# Altium schematic sheet DualUSB3.0_CON.SchDoc
size 420 x 297 mm; SheetNumber: 6; SheetTotal: 11; ModifiedBy: -; CheckedDate: -; Title2: Title 2; DivGrp: WUT ISE; Designer: G.Kasprowicz
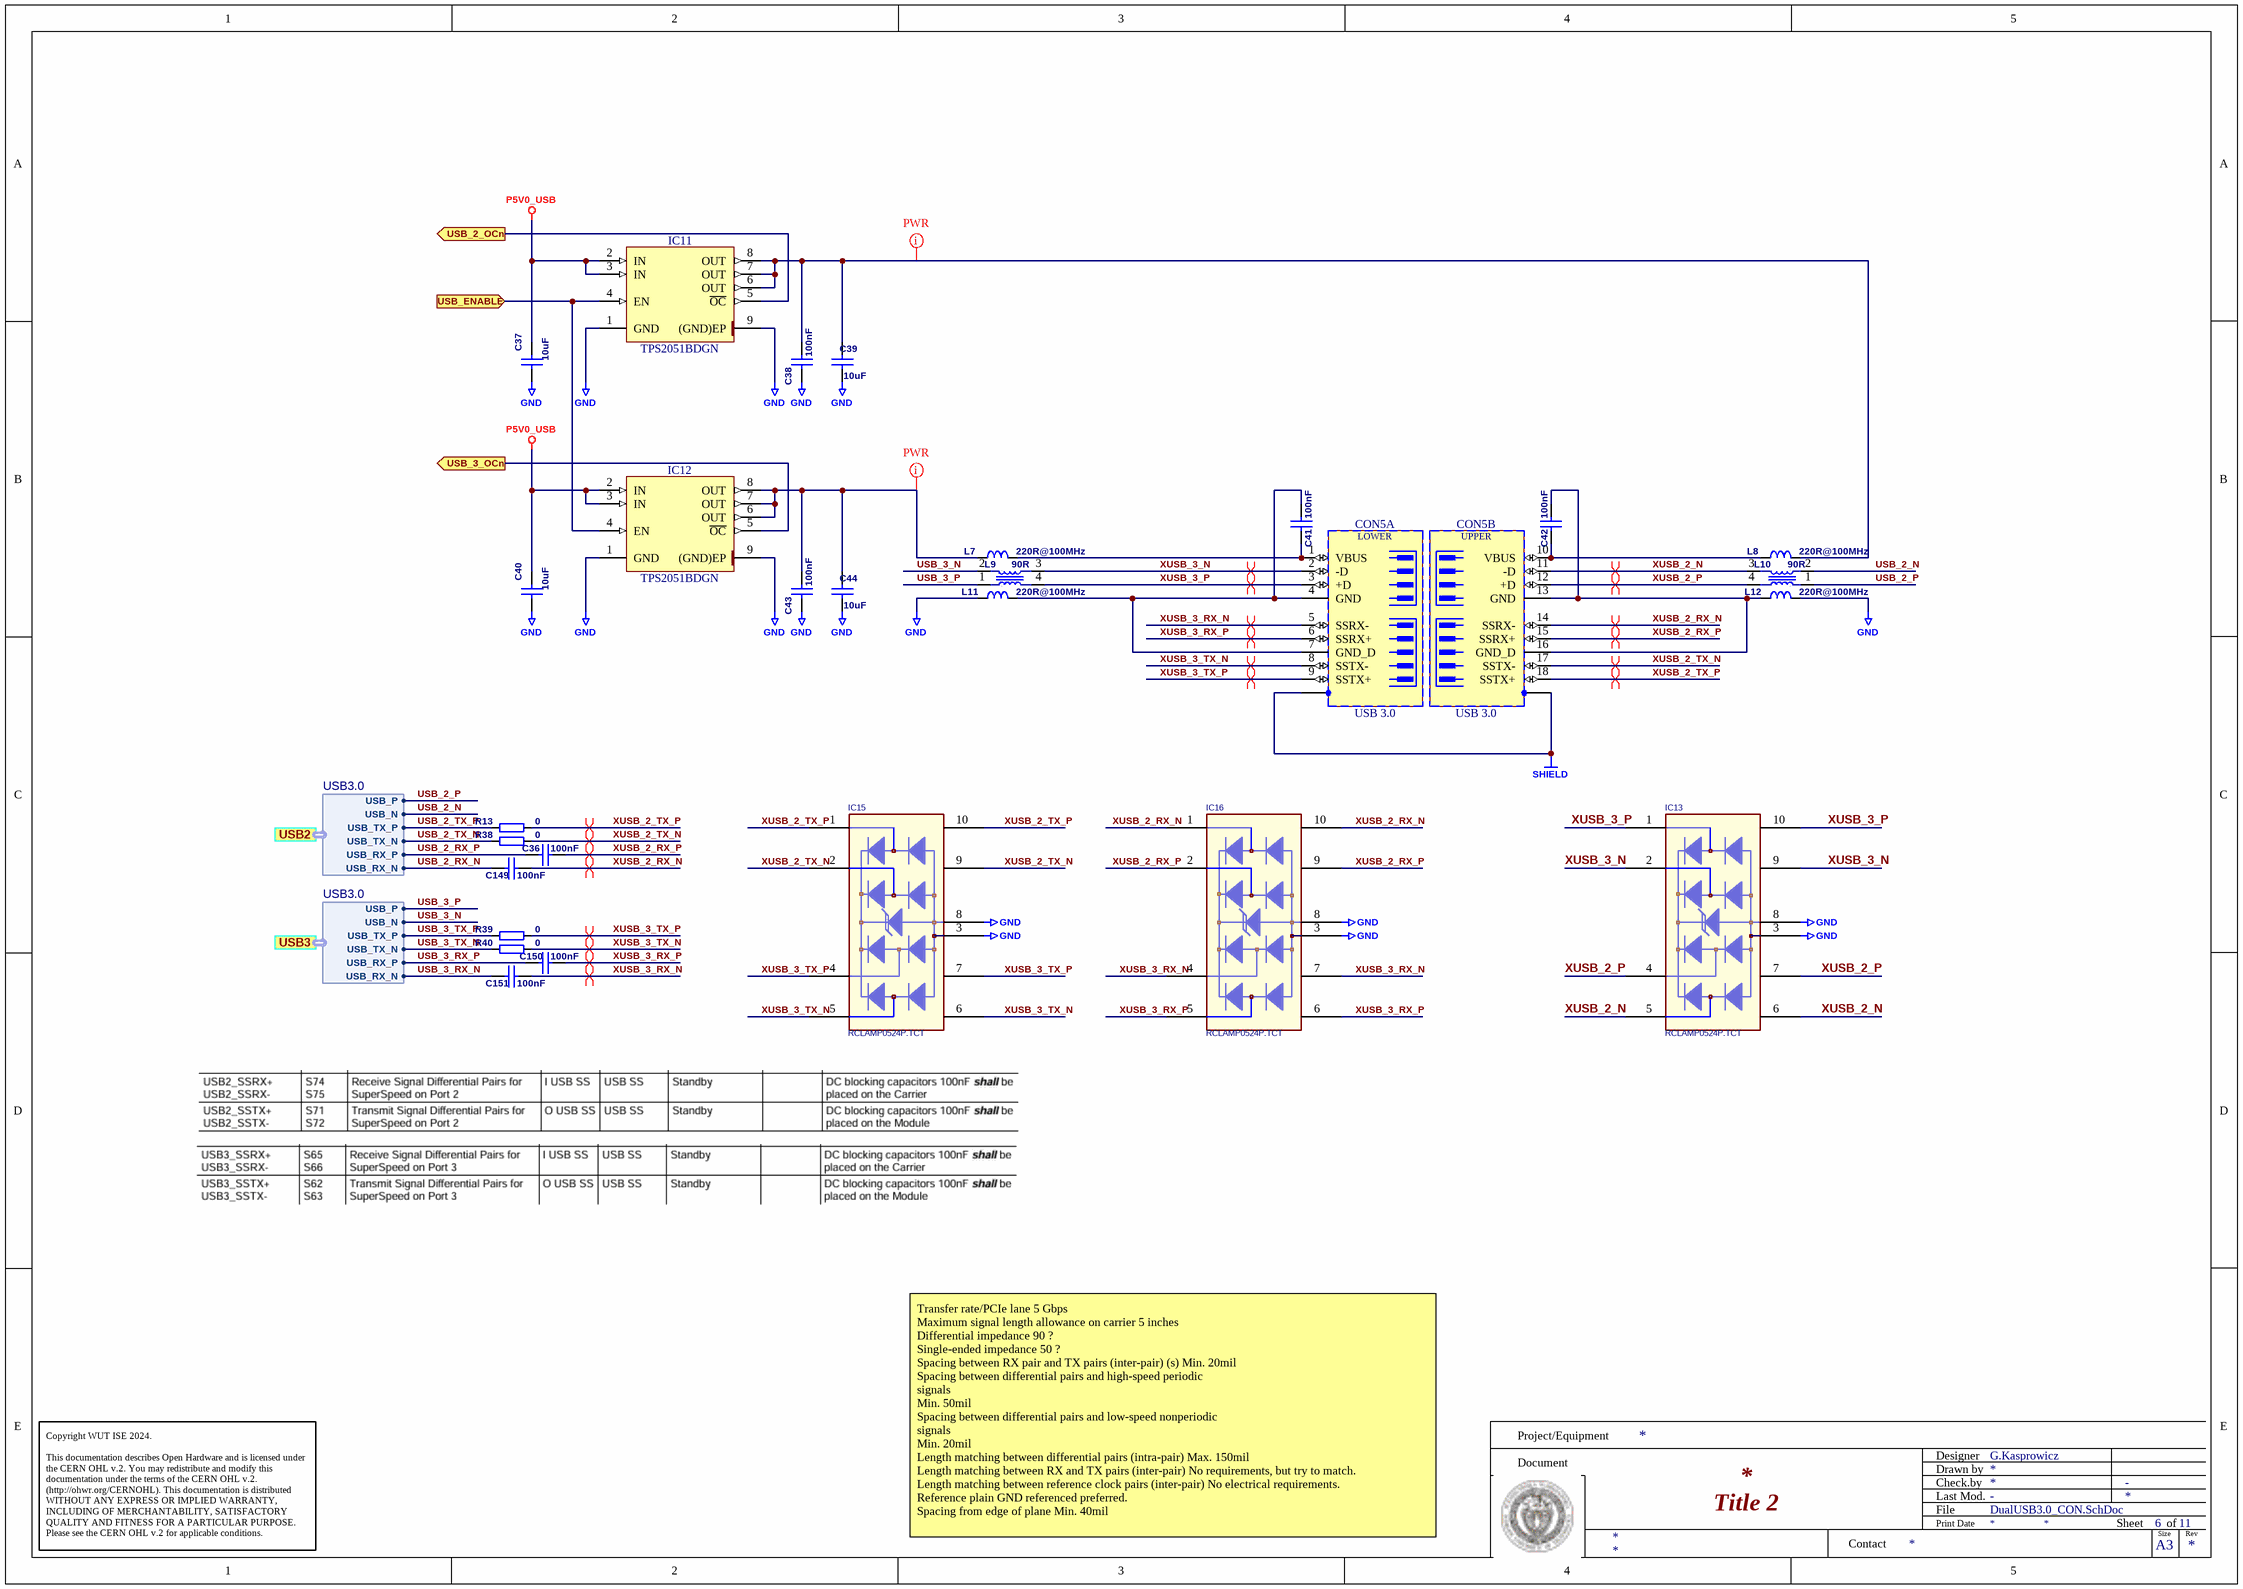
[diagram p0: DualUSB3.0_CON.SchDoc]

## Parts
C36  100nF  [CAPC1005X55N]
C37  10uF  [CAPC2012X135N]
C38  100nF  [CAPC1005X55N]
C39  10uF  [CAPC2012X135N]
C40  10uF  [CAPC2012X135N]
C41  100nF  [CAPC1005X55N]
C42  100nF  [CAPC1005X55N]
C43  100nF  [CAPC1005X55N]
C44  10uF  [CAPC2012X135N]
C149  100nF  [CAPC1005X55N]
C150  100nF  [CAPC1005X55N]
C151  100nF  [CAPC1005X55N]
CON5  USB 3.0  [WURTH_692141030100]  (parts A,B of 2)
IC11  TPS2051BDGN  [SOP65P490X110-9N-R157X189]
IC12  TPS2051BDGN  [SOP65P490X110-9N-R157X189]
IC13  RCLAMP0524P.TCT  [SMDARRAYC_10P4C]
IC15  RCLAMP0524P.TCT  [SMDARRAYC_10P4C]
IC16  RCLAMP0524P.TCT  [SMDARRAYC_10P4C]
L7  220R@100MHz  [INDC2012X105N]
L8  220R@100MHz  [INDC2012X105N]
L9  value 90R  [DLSCM0805]  (hidden comment: DLSCM0805-900M or DLW21SN900SQ2L)
L10  value 90R  [DLSCM0805]  (hidden comment: DLSCM0805-900M or DLW21SN900SQ2L)
L11  220R@100MHz  [INDC2012X105N]
L12  220R@100MHz  [INDC2012X105N]
R13  0  [RESC1005X40N]
R38  0  [RESC1005X40N]
R39  0  [RESC1005X40N]
R40  0  [RESC1005X40N]

## Ports
USB2 (harness USB3.0), USB3 (harness USB3.0), USB_2_OCn (out), USB_3_OCn (out), USB_ENABLE (in)

## Harnesses
USB3.0: USB_P, USB_N, USB_TX_P, USB_TX_N, USB_RX_P, USB_RX_N

## Nets
GND: C37.1 C38.1 C39.1 C40.1 C43.1 C44.1 IC11.1(GND) IC11.9((GND)EP) IC12.1(GND) IC12.9((GND)EP) IC13.3 IC13.8 IC15.3 IC15.8 IC16.3 IC16.8 L11.1 L12.2
P5V0_USB: C37.2 C40.2 IC11.2(IN) IC11.3(IN) IC12.2(IN) IC12.3(IN)
SHIELD: CON5.19(SHIELD) CON5.20(SHIELD)
USB_2_N: L10.2 ; port USB2.USB_N
USB_2_OCn: IC11.5(~{OC}) ; port USB_2_OCn
USB_2_P: L10.1 ; port USB2.USB_P
USB_2_RX_N: C149.1 ; port USB2.USB_RX_N
USB_2_RX_P: C36.1 ; port USB2.USB_RX_P
USB_2_TX_N: R38.1 ; port USB2.USB_TX_N
USB_2_TX_P: R13.1 ; port USB2.USB_TX_P
USB_3_N: L9.2 ; port USB3.USB_N
USB_3_OCn: IC12.5(~{OC}) ; port USB_3_OCn
USB_3_P: L9.1 ; port USB3.USB_P
USB_3_RX_N: C151.1 ; port USB3.USB_RX_N
USB_3_RX_P: C150.1 ; port USB3.USB_RX_P
USB_3_TX_N: R40.1 ; port USB3.USB_TX_N
USB_3_TX_P: R39.1 ; port USB3.USB_TX_P
USB_ENABLE: IC11.4(EN) IC12.4(EN) ; port USB_ENABLE
XUSB_2_N: CON5.11(-D) IC13.5 IC13.6 L10.3
XUSB_2_P: CON5.12(+D) IC13.4 IC13.7 L10.4
XUSB_2_RX_N: C149.2 CON5.14(SSRX-) IC16.1 IC16.10
XUSB_2_RX_P: C36.2 CON5.15(SSRX+) IC16.2 IC16.9
XUSB_2_TX_N: CON5.17(SSTX-) IC15.2 IC15.9 R38.2
XUSB_2_TX_P: CON5.18(SSTX+) IC15.1 IC15.10 R13.2
XUSB_3_N: CON5.2(-D) IC13.2 IC13.9 L9.3
XUSB_3_P: CON5.3(+D) IC13.1 IC13.10 L9.4
XUSB_3_RX_N: C151.2 CON5.5(SSRX-) IC16.4 IC16.7
XUSB_3_RX_P: C150.2 CON5.6(SSRX+) IC16.5 IC16.6
XUSB_3_TX_N: CON5.8(SSTX-) IC15.5 IC15.6 R40.2
XUSB_3_TX_P: CON5.9(SSTX+) IC15.4 IC15.7 R39.2
NetC38_2: C38.2 C39.2 IC11.6(OUT) IC11.7(OUT) IC11.8(OUT) L8.2
NetC41_1: C41.1 CON5.1(VBUS) L7.2
NetC41_2: C41.2 CON5.4(GND) CON5.7(GND_D) L11.2
NetC42_1: C42.1 CON5.10(VBUS) L8.1
NetC42_2: C42.2 CON5.13(GND) CON5.16(GND_D) L12.1
NetC43_2: C43.2 C44.2 IC12.6(OUT) IC12.7(OUT) IC12.8(OUT) L7.1

## Layout directives
differential pair: XUSB_2_N, XUSB_2_P, XUSB_2_RX_N, XUSB_2_RX_P, XUSB_2_TX_N, XUSB_2_TX_P, XUSB_3_N, XUSB_3_P, XUSB_3_RX_N, XUSB_3_RX_P, XUSB_3_TX_N, XUSB_3_TX_P
net class PWR: NetC38_2, NetC43_2

## Notes on the sheet
- Transfer rate/PCIe lane 5 Gbps
  Maximum signal length allowance on carrier 5 inches
  Differential impedance 90 ?
  Single-ended impedance 50 ?
  Spacing between RX pair and TX pairs (inter-pair) (s) Min. 20mil
  Spacing between differential pairs and high-speed periodic
  signals
  Min. 50mil
  Spacing between differential pairs and low-speed nonperiodic
  signals
  Min. 20mil
  Length matching between differential pairs (intra-pair) Max. 150mil
  Length matching between RX and TX pairs (inter-pair) No requirements, but try to match.
  Length matching between reference clock pairs (inter-pair) No electrical requirements.
  Reference plain GND referenced preferred.
  Spacing from edge of plane Min. 40mil
- Project/Equipment
- Document
- Designer
- Drawn by
- Check.by
- Copyright WUT ISE 2024.
  This documentation describes Open Hardware and is licensed under the CERN OHL v.2. You may redistribute and modify this documentation under the terms of the CERN OHL v.2. (http://ohwr.org/CERNOHL). This documentation is distributed WITHOUT ANY EXPRESS OR IMPLIED WARRANTY, INCLUDING OF MERCHANTABILITY, SATISFACTORY QUALITY AND FITNESS FOR A PARTICULAR PURPOSE. Please see the CERN OHL v.2 for applicable conditions.
- Contact
- File
- Last Mod.
- Print Date
- Sheet
- Size
- A3
- of
- Rev
- (in symbol WURTH_692141030100, part A) LOWER
- (in symbol WURTH_692141030100, part B) UPPER

## Library data of the parts
C36 C38 C41-C43 C149-C151 = CC0402_100NF_16V_10%_X7R: Non-polarised capacitor; Part Description: SMD Multilayer Chip Ceramic Capacitor; Manufacturer: GENERIC; Manufacturer1 Part Number: GRM155R71C104KA88D; Voltage: 16V; TC: X7R; Tolerance: ±10%; Part Number: CC0402_100NF_16V_10%_X7R; Component Kind: Standard; Component Type: Standard; Pin Count: 2; Value: 100nF; Status: Not Recommended; Manufacturer Part Number: CC0402_100NF_16V_10%_X7R; Case: 0402; Mounted: Yes; Socket: No; SMD: Yes; Sense: No; Manufacturer1 Example: MURATA; Manufacturer1 ComponentHeight: 0.55mm; HelpURL: \\cern.ch\dfs\Applications\Altium\Datasheets\CC0402_X7R_MURATA_GRM.pdf; Author: CERN DEM JLC; CreateDate: 05/12/2013; LatestRevisionDate: 03/12/2007
C37 C39 C40 C44 = CC0805_10UF_10V_10%_X7R: Non-polarised capacitor; Part Description: SMD Multilayer Chip Ceramic Capacitor; Manufacturer: GENERIC; Manufacturer1 Part Number: GRM21BR71A106KE51L; Voltage: 10V; TC: X7R; Tolerance: ±10%; Table: Capacitors SMD; Part Number: CC0805_10UF_10V_10%_X7R; Component Kind: Standard; Component Type: Standard; Pin Count: 2; Value: 10uF; Status: Preferred; Manufacturer Part Number: CC0805_10UF_10V_10%_X7R; Case: 0805; Mounted: Yes; Socket: No; SMD: Yes; Manufacturer1 Example: MURATA; Manufacturer1 ComponentHeight: 1.35mm; HelpURL: \\cern.ch\dfs\Applications\Altium\Datasheets\CC0805_X7R_MURATA.pdf; Author: CERN DEM JLC; CreateDate: 2012-04-30; LatestRevisionDate: 2012-04-30
CON5 = WURTH_692141030100: 2x9 Pin + 1 Shield  Duals USB 3.0 Type A Receptacle; Part Description: USB 3.0 Type A Stacked Right Angle Receptacles; Manufacturer: WURTH ELEKTRONIK; Table: Miscellaneous; Part Number: WURTH_692141030100; Component Kind: Standard; Component Type: Standard; Pin Count: 19; Family: USB 3.0; Mounted: Yes; Socket: No; SMD: No; Status: None; Manufacturer Part Number: 692141030100; ComponentHeight: 16.11mm; HelpURL: \\cern.ch\dfs\Applications\Altium\Datasheets\WURTH_692141030100.pdf; Author: CERN DEM JLC; CreateDate: 2013-06-27; LatestRevisionDate: 2013-06-27
IC11 IC12 = TPS2051BDGN: One Channel, Current-Limited, Power-Distribution Switches; Part Description: One Channel, Current-Limited (500mA), Power-Distribution Switches; Manufacturer: TEXAS INSTRUMENTS; PressFit: No; Bonding: No; Part Number: TPS2051BDGN; Component Kind: Standard; Component Type: Standard; Device: TPS2051BDGN; PackageDescription: SOP, 0.65mm Pitch; 8 Pin, 3.00mm W X 3.00mm L X 1.10mm H body (w/Thermal Tab 1.57 X 1.89mm), IPC Medium Density; Manufacturer Part Number: TPS2051BDGN; Pin Count: 8; Case: SSOP8; Mounted: Yes; Socket: No; SMD: Yes; Sense: No; ComponentHeight: 1.1mm; Author: CERN DEM BC; HelpURL: \\cern.ch\dfs\Applications\Altium\Datasheets\TPS2051BDGN.pdf; CreateDate: 06.07.2020; LatestRevisionDate: 06.07.2020
IC13 IC15 IC16 = D_TVS_RCLAMP0524P: DIODE,RCLAMP0524P,SEMTECH; Specification: SMD,ESD COMPONENT,ROHS
L7 L8 L11 L12 = IND0805_MURATA_BLM21PG221SN1D: Inductor; Part Description: SMD EMIFIL Suppression Chip Ferrite Bead; Manufacturer: MURATA; Power: 2A; Resistance: 0.05R; Tolerance: ±25%; Table: Inductors SMD; Part Number: IND0805_MURATA_BLM21PG221SN1D; Component Kind: Standard; Component Type: Standard; Pin Count: 2; Value: 220R@100MHz; Status: None; Manufacturer Part Number: BLM21PG221SN1D; Case: 0805; Mounted: Yes; Socket: No; SMD: Yes; ComponentHeight: 1.05mm; HelpURL: \\cern.ch\dfs\Applications\Altium\Datasheets\IND0402_MURATA_BLM21P.pdf; Author: CERN DEM JLC; CreateDate: 2010-01-25; LatestRevisionDate: 2010-01-25
L9 L10 = L_CMC_DLSCM0805_90R: Common Mode Choke 90R
R13 R38-R40 = R0402_0R_JUMPER: Resistor; Part Description: 1A (0.05R Max DC Resistance) Zero Ohm Jumper; Manufacturer: GENERIC; Manufacturer1 Part Number: 232270591001L; PressFit: No; Part Number: R0402_0R_JUMPER; Component Kind: Standard; Component Type: Standard; Pin Count: 2; Value: 0; Status: Not Recommended; Manufacturer Part Number: R0402_0R_JUMPER; Case: 0402; Mounted: Yes; Sense: No; Socket: No; SMD: Yes; Manufacturer1 Example: YAGEO PHYCOMP; Manufacturer1 ComponentHeight: 0.4mm; HelpURL: \\cern.ch\dfs\Applications\Altium\Datasheets\R0402_Phycomp_RC0402.pdf; Author: CERN DEM JLC; CreateDate: 03.12.2007; LatestRevisionDate: 17.10.2012